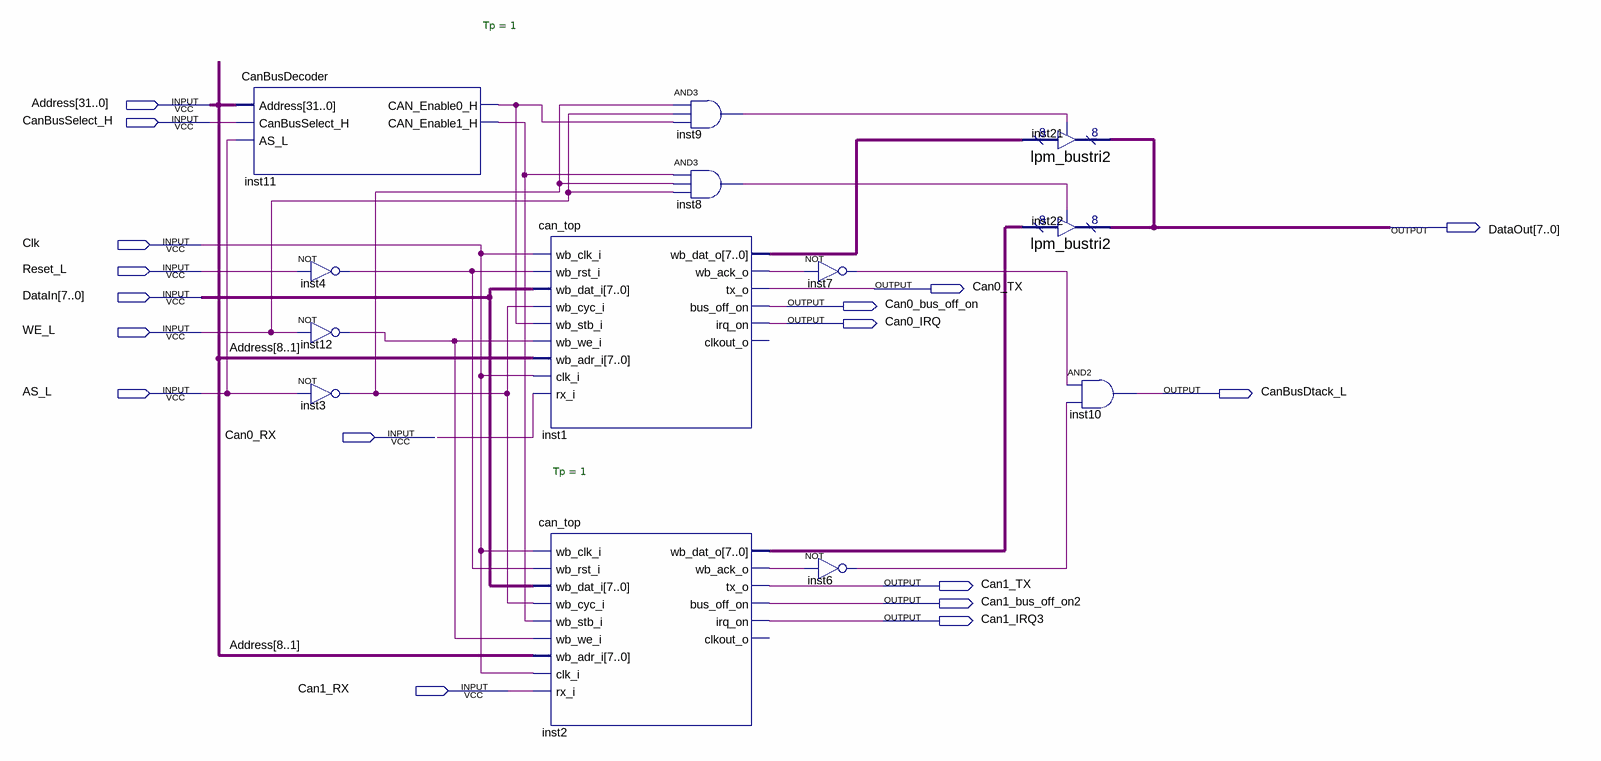
[diagram p0: schematic sheet]
// Quartus schematic CanBus.bdf as structural Verilog: 13 symbols, 17 pins
module CanBus (
  input  [31:0] Address,
  input  CanBusSelect_H,
  input  Clk,
  input  Reset_L,
  input  [7:0] DataIn,
  input  WE_L,
  input  AS_L,
  input  Can0_RX,
  input  Can1_RX,
  output [7:0] DataOut,
  output Can0_TX,
  output Can0_bus_off_on,
  output Can0_IRQ,
  output CanBusDtack_L,
  output Can1_TX,
  output Can1_bus_off_on2,
  output Can1_IRQ3
);

  wire inst1_wb_ack_o, inst2_wb_ack_o, inst3_out, inst4_out, inst6_out, inst7_out, inst8_out, inst9_out,
       inst11_can_enable0_h, inst11_can_enable1_h, inst12_out;
  wire [7:0] inst1_wb_dat_o, inst2_wb_dat_o;

  CanBusDecoder inst11 (
    .Address(Address), .CanBusSelect_H(CanBusSelect_H), .AS_L(AS_L), .CAN_Enable0_H(inst11_can_enable0_h),
    .CAN_Enable1_H(inst11_can_enable1_h));
  not inst4 (inst4_out, Reset_L);
  not inst12 (inst12_out, WE_L);
  not inst3 (inst3_out, AS_L);
  can_top #(.Tp(1)) inst1 (
    .wb_clk_i(Clk), .wb_rst_i(inst4_out), .wb_dat_i(DataIn), .wb_cyc_i(inst3_out),
    .wb_stb_i(inst11_can_enable0_h), .wb_we_i(inst12_out), .wb_adr_i(Address[8:1]), .clk_i(Clk),
    .rx_i(Can0_RX), .wb_dat_o(inst1_wb_dat_o), .wb_ack_o(inst1_wb_ack_o), .tx_o(Can0_TX),
    .bus_off_on(Can0_bus_off_on), .irq_on(Can0_IRQ));  // open: clkout_o
  can_top #(.Tp(1)) inst2 (
    .wb_clk_i(Clk), .wb_rst_i(inst4_out), .wb_dat_i(DataIn), .wb_cyc_i(inst3_out),
    .wb_stb_i(inst11_can_enable1_h), .wb_we_i(inst12_out), .wb_adr_i(Address[8:1]), .clk_i(Clk),
    .rx_i(Can1_RX), .wb_dat_o(inst2_wb_dat_o), .wb_ack_o(inst2_wb_ack_o), .tx_o(Can1_TX),
    .bus_off_on(Can1_bus_off_on2), .irq_on(Can1_IRQ3));  // open: clkout_o
  and inst9 (inst9_out, inst3_out, WE_L, inst11_can_enable0_h);
  and inst8 (inst8_out, inst11_can_enable1_h, inst3_out, WE_L);
  not inst7 (inst7_out, inst1_wb_ack_o);
  not inst6 (inst6_out, inst2_wb_ack_o);
  lpm_bustri2 inst21 (.enabledt(inst9_out), .data(inst1_wb_dat_o), .tridata(DataOut));
  lpm_bustri2 inst22 (.enabledt(inst8_out), .data(inst2_wb_dat_o), .tridata(DataOut));
  and inst10 (CanBusDtack_L, inst7_out, inst6_out);
endmodule
